# EAGLE design RPi_SPI_outputs_v01 (EAGLE 7.2.0)
AUTHOR: M.Petrilak; VERSION: 01
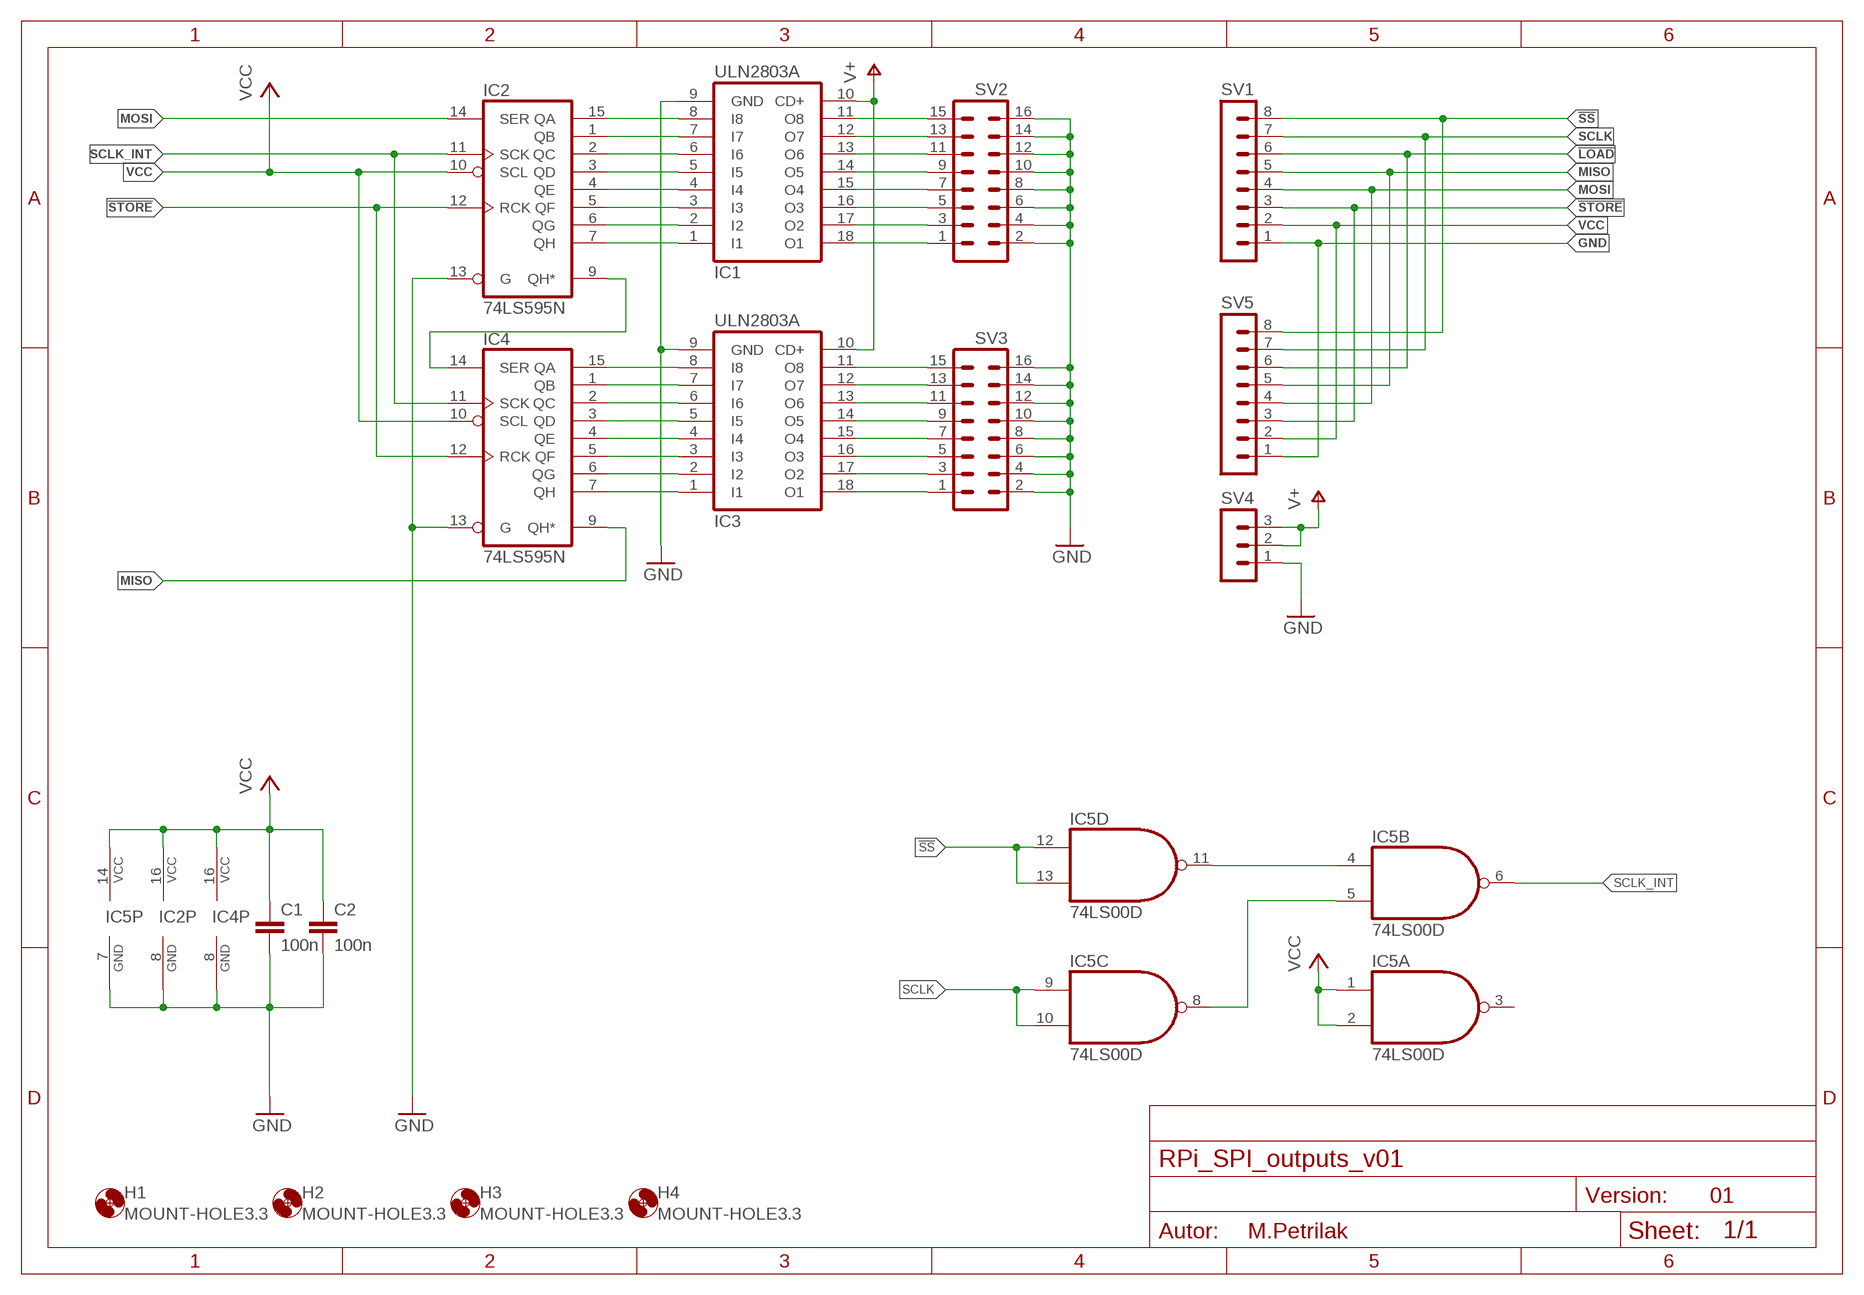
[diagram p0: schematic, sheet 1]

## Parts
C1  100n  C-EUC1206  [C1206]
C2  100n  C-EUC1206  [C1206]
H1  MOUNT-HOLE3.3  [3,3]
H2  MOUNT-HOLE3.3  [3,3]
H3  MOUNT-HOLE3.3  [3,3]
H4  MOUNT-HOLE3.3  [3,3]
IC1  ULN2803A  [DIL18]
IC2  74LS595N  [DIL16]
IC3  ULN2803A  [DIL18]
IC4  74LS595N  [DIL16]
IC5  74LS00D  [SO14]
SV1  MA08-1  [MA08-1]
SV2  MA08-2-OP  [MA08-2-OP]
SV3  MA08-2-OP  [MA08-2-OP]
SV4  MA03-1_NO  [MA03-1_NO]
SV5  MA08-1  [MA08-1]

## Nets
!LOAD: SV1.6 SV5.6
!SS: IC5.12(D:I0) IC5.13(D:I1) SV1.8 SV5.8
!STORE: IC2.12(RCK) IC4.12(RCK) SV1.3 SV5.3
DIN_1: IC2.9(QH*) IC4.14(SER)
GND: C1.2 C2.2 IC1.9(GND) IC2.8(GND) IC2.13(G) IC3.9(GND) IC4.8(GND) IC4.13(G) IC5.7(P:GND) SV1.1 SV2.2 SV2.4 SV2.6 SV2.8 SV2.10 SV2.12 SV2.14 SV2.16 SV3.2 SV3.4 SV3.6 SV3.8 SV3.10 SV3.12 SV3.14 SV3.16 SV4.1 SV5.1
MISO: IC4.9(QH*) SV1.5 SV5.5
MOSI: IC2.14(SER) SV1.4 SV5.4
N$1: IC1.8(I8) IC2.15(QA)
N$2: IC1.7(I7) IC2.1(QB)
N$3: IC1.6(I6) IC2.2(QC)
N$4: IC1.5(I5) IC2.3(QD)
N$5: IC1.4(I4) IC2.4(QE)
N$6: IC1.3(I3) IC2.5(QF)
N$7: IC1.2(I2) IC2.6(QG)
N$8: IC1.1(I1) IC2.7(QH)
N$9: IC3.8(I8) IC4.15(QA)
N$10: IC3.7(I7) IC4.1(QB)
N$11: IC3.6(I6) IC4.2(QC)
N$12: IC3.5(I5) IC4.3(QD)
N$13: IC3.4(I4) IC4.4(QE)
N$14: IC3.3(I3) IC4.5(QF)
N$15: IC3.2(I2) IC4.6(QG)
N$16: IC3.1(I1) IC4.7(QH)
N$19: IC5.4(B:I0) IC5.11(D:O)
N$20: IC5.5(B:I1) IC5.8(C:O)
N$36: IC3.11(O8) SV3.15
N$37: IC3.12(O7) SV3.13
N$38: IC3.13(O6) SV3.11
N$39: IC3.14(O5) SV3.9
N$40: IC3.15(O4) SV3.7
N$42: IC1.11(O8) SV2.15
N$43: IC1.12(O7) SV2.13
N$44: IC1.13(O6) SV2.11
N$45: IC1.14(O5) SV2.9
N$46: IC1.15(O4) SV2.7
N$47: IC1.16(O3) SV2.5
N$48: IC1.17(O2) SV2.3
N$49: IC1.18(O1) SV2.1
N$50: IC3.16(O3) SV3.5
N$51: IC3.17(O2) SV3.3
N$52: IC3.18(O1) SV3.1
SCLK: IC5.9(C:I0) IC5.10(C:I1) SV1.7 SV5.7
SCLK_INT: IC2.11(SCK) IC4.11(SCK) IC5.6(B:O)
V+: IC1.10(CD+) IC3.10(CD+) SV4.2 SV4.3
VCC: C1.1 C2.1 IC2.10(SCL) IC2.16(VCC) IC4.10(SCL) IC4.16(VCC) IC5.1(A:I0) IC5.2(A:I1) IC5.14(P:VCC) SV1.2 SV5.2
Unconnected: IC5.3(A:O)

## Library data of the parts
C1 C2 = rcl:C-EU: CAPACITOR, European symbol
H1-H4 = holes:MOUNT-HOLE: MOUNTING HOLE with drill center marker
IC1 IC3 = uln-udn:ULN2803A: DRIVER ARRAY
IC2 IC4 = 74xx-us:74*595: 8-bit SHIFT REGISTER, output latch
IC5 = 74xx-us:74*00: Quad 2-input NAND gate
SV1 SV5 = con-lstb:MA08-1: PIN HEADER
SV2 SV3 = con-lstb:MA08-2: PIN HEADER
SV4 = con-lstb:MA03-1: PIN HEADER

## Board
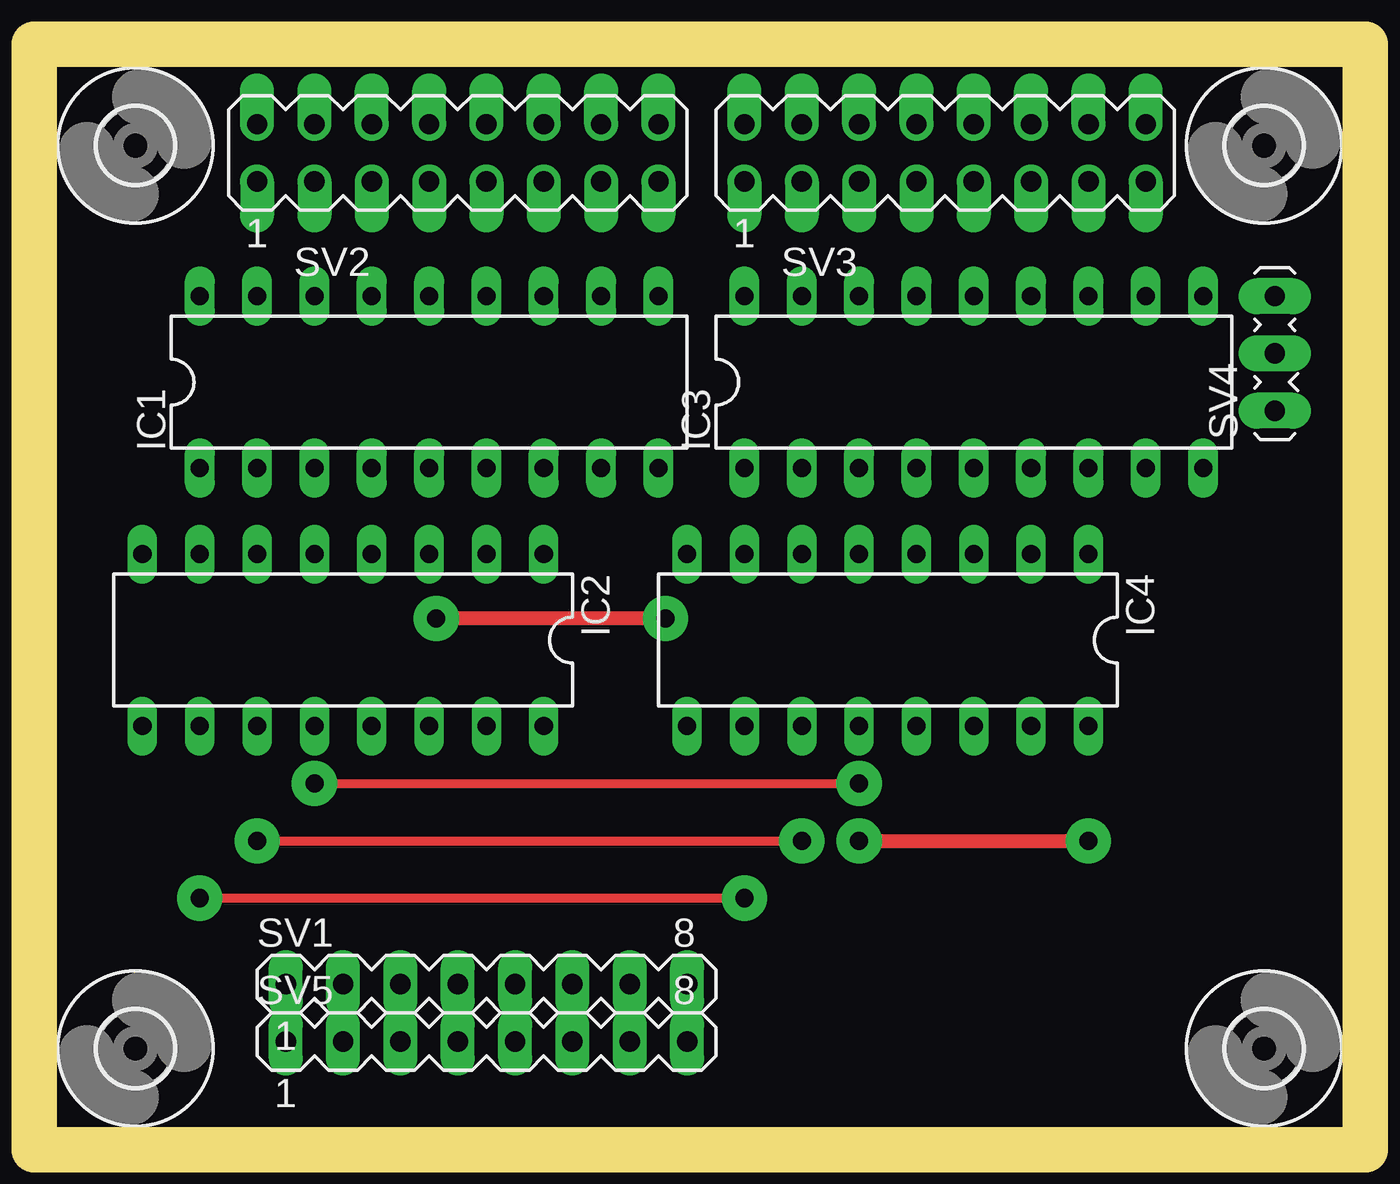
[diagram p1: board, top side]
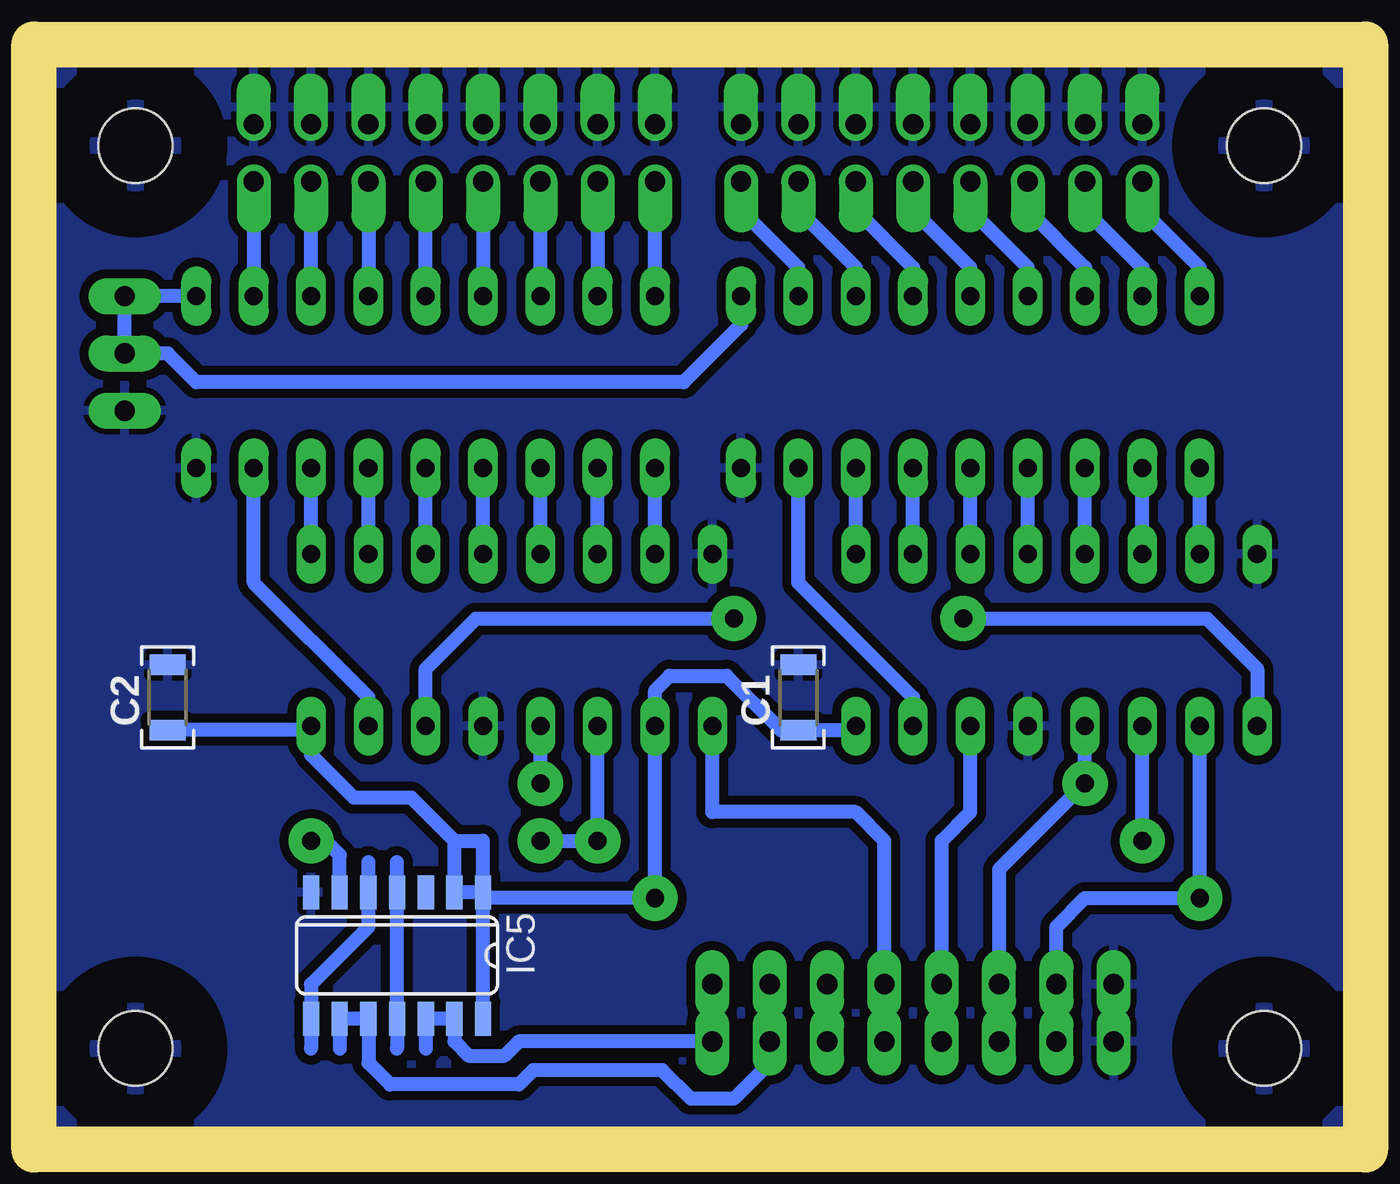
[diagram p2: board, bottom side, seen from below]

Size 57 x 47 mm. Coordinates in mm from the lower left corner, seen from the top.
Outline: 0,0 57,0 57,47 0,47 0,0
Copper layers (1*16): Top 0.035mm / dielectric 1.5mm / Bottom 0.035mm
Design rules "Michal_CNC_doma": minimum track width 0.3mm, minimum drill 0.6mm, track to track 0.4mm, track to pad 0.4mm, pad to pad 0.5mm, via to via 1mm, smd to smd 8mil, copper to edge 1mil, drill to drill 8mil, minimum pad ring 10mil, minimum via ring 8mil, stop-mask expansion 4mil, vias tented up to drill 0mil, thermal gap 10mil
Milling: 4 lines

### Footprints (pad centres in the part's own frame; a part is rotated, then mirrored left to right if it is on the bottom)
C1206 = smd 0.9 x 1.6: 1 -1.45,0; 2 1.45,0
3,3 = hole 3.3: 0,0
DIL18 = drill 0.8 pad 1.32 long: 1 -10.16,-3.81; 2 -7.62,-3.81; 3 -5.08,-3.81; 4 -2.54,-3.81; 5 0,-3.81; 6 2.54,-3.81; 7 5.08,-3.81; 8 7.62,-3.81; 9 10.16,-3.81; 10 10.16,3.81; 11 7.62,3.81; 12 5.08,3.81; 13 2.54,3.81; 14 0,3.81; 15 -2.54,3.81; 16 -5.08,3.81; 17 -7.62,3.81; 18 -10.16,3.81
DIL16 = drill 0.8 long: 1 -8.89,-3.81; 2 -6.35,-3.81; 3 -3.81,-3.81; 4 -1.27,-3.81; 5 1.27,-3.81; 6 3.81,-3.81; 7 6.35,-3.81; 8 8.89,-3.81; 9 8.89,3.81; 10 6.35,3.81; 11 3.81,3.81; 12 1.27,3.81; 13 -1.27,3.81; 14 -3.81,3.81; 15 -6.35,3.81; 16 -8.89,3.81
SO14 = smd 0.72 x 1.5: 1 -3.81,-2.8; 2 -2.54,-2.8; 3 -1.27,-2.8; 4 0,-2.8; 5 1.27,-2.8; 6 2.54,-2.8; 7 3.81,-2.8; 8 3.81,2.8; 9 2.54,2.8; 10 1.27,2.8; 11 0,2.8; 12 -1.27,2.8; 13 -2.54,2.8; 14 -3.81,2.8
MA08-1 = drill 0.9 pad 1.5 long: 1 -8.89,0; 2 -6.35,0; 3 -3.81,0; 4 -1.27,0; 5 1.27,0; 6 3.81,0; 7 6.35,0; 8 8.89,0
MA08-2-OP = drill 0.9 pad 1.5 offset: 1 -8.89,-1.27; 2 -8.89,1.27; 3 -6.35,-1.27; 4 -6.35,1.27; 5 -3.81,-1.27; 6 -3.81,1.27; 7 -1.27,-1.27; 8 -1.27,1.27; 9 1.27,-1.27; 10 1.27,1.27; 11 3.81,-1.27; 12 3.81,1.27; 13 6.35,-1.27; 14 6.35,1.27; 15 8.89,-1.27; 16 8.89,1.27
MA03-1_NO = drill 0.9 pad 1.6 long: 1 -2.54,0; 2 0,0; 3 2.54,0

### Placement (x,y rotation side)
C1  24.13,19.05 90 bottom
C2  52.07,19.05 90 bottom
H1  3.5,3.5 0 top
H2  53.5,3.5 0 top
H3  53.5,43.5 0 top
H4  3.5,43.5 0 top
IC1  16.51,33.02 0 top
IC2  12.7,21.59 180 top
IC3  40.64,33.02 0 top
IC4  36.83,21.59 180 top
IC5  41.91,7.62 180 bottom
SV1  19.05,6.35 0 top
SV2  17.78,43.18 0 top
SV3  39.37,43.18 0 top
SV4  53.98,34.29 90 top
SV5  19.05,3.81 0 top

### Tracks (layer width: path | path; a pad name or v marks a point on that pad's centre or on a via)
!LOAD
  Bottom 0.61: SV5.6 SV1.6
!SS
  Bottom 0.61: SV1.8 SV5.8 36.51,3.81 37.15,3.17 38.73,3.17 39.37,3.81 IC5.13 IC5.12 40.64,3.49
!STORE  (via drill 0.8 pad 2)
  Top 0.406: v11.43,15.24 v35.56,15.24
  Bottom 0.406: IC2.12 11.43,16.51
  Bottom 0.61: v35.56,15.24 IC4.12 | SV5.3 SV1.3 15.24,11.43 v11.43,15.24 IC2.12
DIN_1  (via drill 0.8 pad 2)
  Top 0.61: v26.99,22.54 v16.83,22.54
  Bottom 0.61: IC4.14 40.64,20.32 38.42,22.54 v26.99,22.54 | v16.83,22.54 6.03,22.54 3.81,20.32 IC2.9
GND
  pour Bottom: 0,0 57,0 57,47 0,47
MISO
  Bottom 0.61: SV5.5 SV1.5 20.32,12.7 21.59,13.97 27.94,13.97 IC4.9
MOSI
  Bottom 0.61: SV5.4 SV1.4 17.78,12.7 16.51,13.97 IC2.14
N$1
  Bottom 0.61: IC2.15 19.05,19.05 24.13,24.13 IC1.8
N$2
  Bottom 0.61: IC2.1 IC1.7
N$3
  Bottom 0.61: IC2.2 IC1.6
N$4
  Bottom 0.61: IC2.3 IC1.5
N$5
  Bottom 0.61: IC2.4 IC1.4
N$6
  Bottom 0.61: IC2.5 IC1.3
N$7
  Bottom 0.61: IC2.6 IC1.2
N$8
  Bottom 0.61: IC2.7 IC1.1
N$9
  Bottom 0.61: IC4.15 43.18,19.05 48.26,24.13 IC3.8
N$10
  Bottom 0.61: IC4.1 IC3.7
N$11
  Bottom 0.61: IC4.2 IC3.6
N$12
  Bottom 0.61: IC4.3 IC3.5
N$13
  Bottom 0.61: IC4.4 IC3.4
N$14
  Bottom 0.61: IC4.5 IC3.3
N$15
  Bottom 0.61: IC4.6 IC3.2
N$16
  Bottom 0.61: IC4.7 IC3.1
N$19
  Bottom 0.61: 41.91,3.49 IC5.11 IC5.4 41.91,11.75
N$20
  Bottom 0.61: 45.72,3.49 IC5.8 45.72,6.35 43.18,8.89 IC5.5 43.18,11.75
N$36
  Bottom 0.61: SV3.15 IC3.11
N$37
  Bottom 0.61: IC3.12 SV3.13
N$38
  Bottom 0.61: SV3.11 IC3.13
N$39
  Bottom 0.61: IC3.14 SV3.9
N$40
  Bottom 0.61: SV3.7 IC3.15
N$42
  Bottom 0.61: IC1.11 24.13,38.1 26.67,40.64 SV2.15
N$43
  Bottom 0.61: IC1.12 21.59,38.1 24.13,40.64 SV2.13
N$44
  Bottom 0.61: IC1.13 19.05,38.1 21.59,40.64 SV2.11
N$45
  Bottom 0.61: IC1.14 16.51,38.1 19.05,40.64 SV2.9
N$46
  Bottom 0.61: IC1.15 13.97,38.1 16.51,40.64 SV2.7
N$47
  Bottom 0.61: IC1.16 11.43,38.1 13.97,40.64 SV2.5
N$48
  Bottom 0.61: IC1.17 8.89,38.1 11.43,40.64 SV2.3
N$49
  Bottom 0.61: IC1.18 6.35,38.1 8.89,40.64 SV2.1
N$50
  Bottom 0.61: IC3.16 SV3.5
N$51
  Bottom 0.61: SV3.3 IC3.17
N$52
  Bottom 0.61: IC3.18 SV3.1
SCLK
  Bottom 0.61: SV1.7 SV5.7 25.4,2.86 26.99,1.27 28.89,1.27 30.16,2.54 35.88,2.54 36.51,1.91 42.23,1.91 43.18,2.86 IC5.10 IC5.9 44.45,3.49
SCLK_INT  (via drill 0.8 pad 2)
  Top 0.406: v8.89,12.7 v33.02,12.7
  Top 0.61: v35.56,12.7 v45.72,12.7
  Bottom 0.61: IC4.11 v33.02,12.7 v35.56,12.7 | v8.89,12.7 IC2.11 | IC5.6 44.45,12.06 45.09,12.7 v45.72,12.7
V+
  Bottom 0.61: IC1.10 26.67,35.56 29.21,33.02 50.8,33.02 52.07,34.29 SV4.2 SV4.3 IC3.10
VCC  (via drill 0.8 pad 2)
  Top 0.406: v6.35,10.16 v30.48,10.16
  Bottom 0.406: 24.9,17.6 C1.1
  Bottom 0.61: C1.1 21.77,17.6 IC2.16 | SV5.2 SV1.2 12.7,8.89 11.43,10.16 v6.35,10.16 IC2.10 | 24.9,17.6 27.3,20 29.84,20 30.48,19.37 IC4.10 v30.48,10.16 38.1,10.16 | IC5.1 IC5.2 39.37,12.7 | IC5.1 38.1,12.7 39.37,12.7 | 39.37,12.7 41.27,14.61 43.81,14.61 45.72,16.51 IC4.16 45.9,17.6 C2.1 | IC5.14 38.1,10.16 | 38.1,10.16 IC5.1